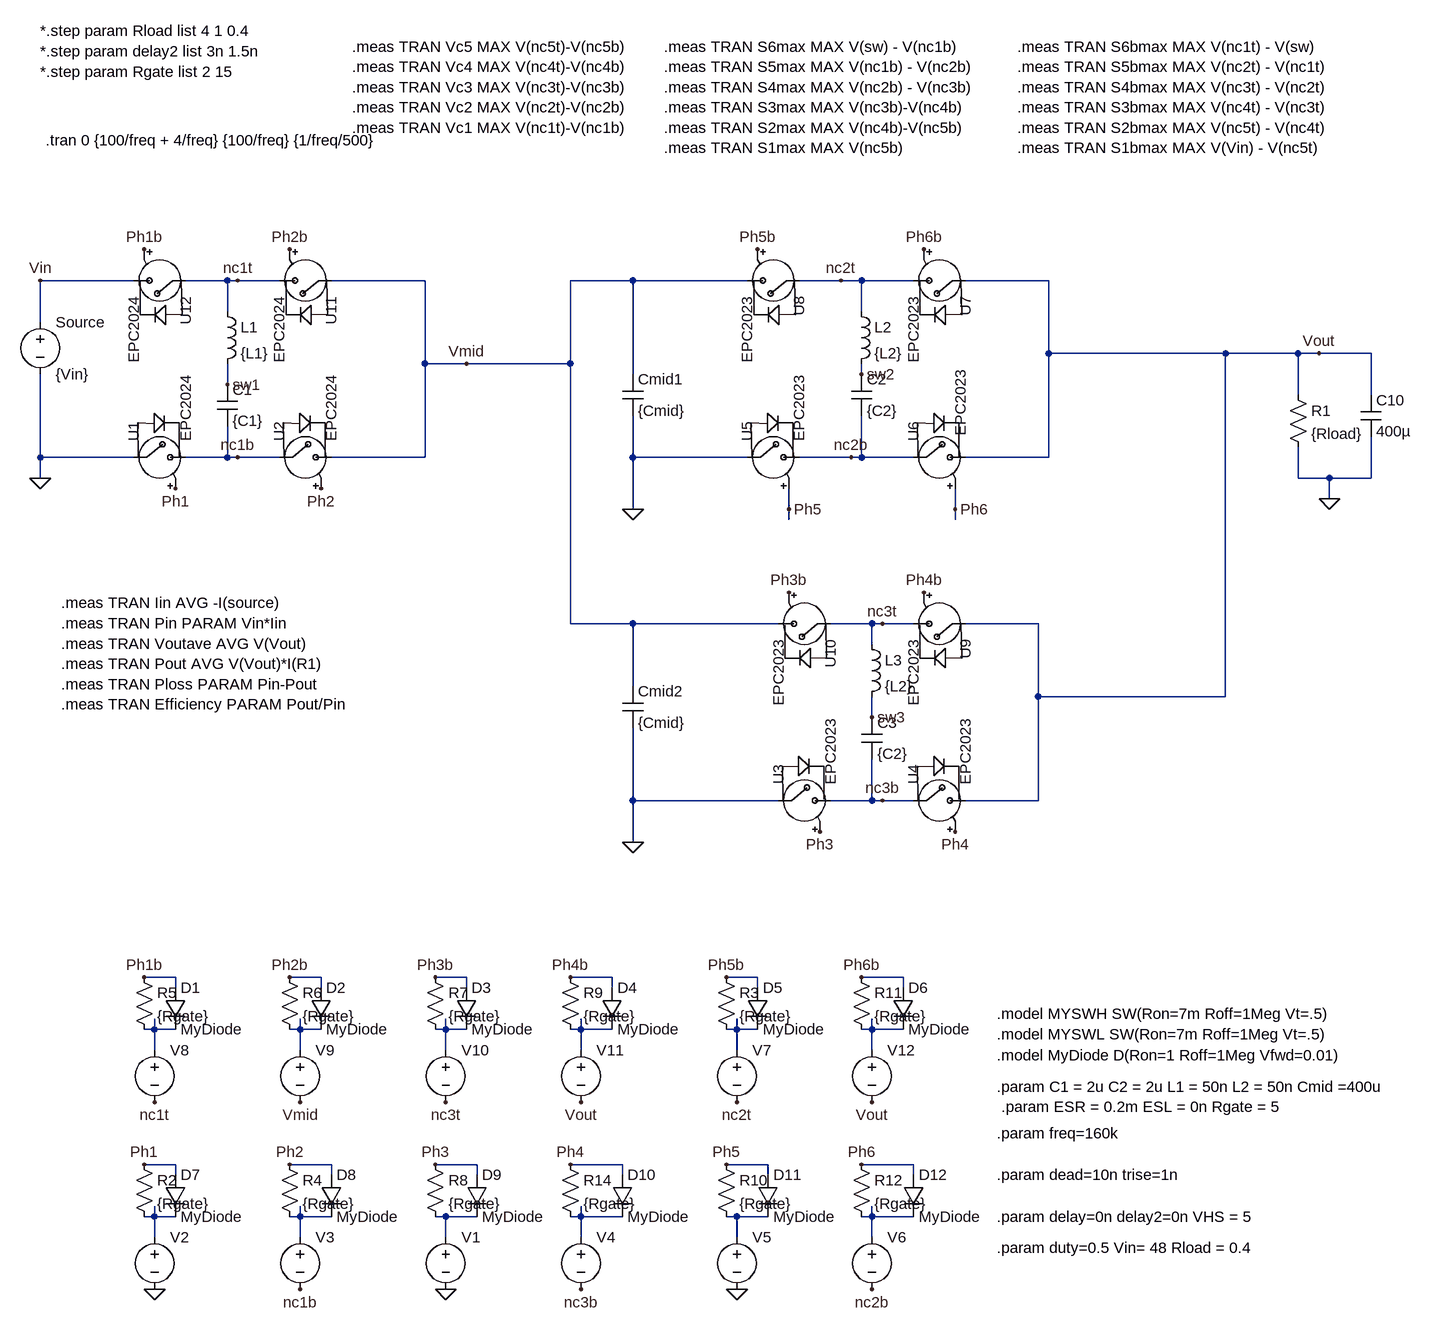
[diagram p0: schematic 3level_squared_EPC_distributed.asc]
3level_squared_EPC_distributed.asc, the LTspice schematic file:
Version 4
SHEET 1 1904 1740
WIRE -1152 80 -1296 80
WIRE -1008 80 -1072 80
WIRE -992 80 -1008 80
WIRE -928 80 -992 80
WIRE -704 80 -848 80
WIRE -384 80 -480 80
WIRE -208 80 -384 80
WIRE -64 80 -128 80
WIRE -32 80 -64 80
WIRE 48 80 -32 80
WIRE 256 80 128 80
WIRE -1008 128 -1008 80
WIRE -32 128 -32 80
WIRE -1296 144 -1296 80
WIRE 256 192 256 80
WIRE 528 192 256 192
WIRE 640 192 528 192
WIRE 672 192 640 192
WIRE 752 192 672 192
WIRE -704 208 -704 80
WIRE -640 208 -704 208
WIRE -480 208 -480 80
WIRE -480 208 -640 208
WIRE -384 224 -384 80
WIRE -32 224 -32 208
WIRE -1008 240 -1008 208
WIRE 640 256 640 192
WIRE 752 256 752 192
WIRE -1296 352 -1296 224
WIRE -1152 352 -1296 352
WIRE -1008 352 -1008 304
WIRE -1008 352 -1072 352
WIRE -992 352 -1008 352
WIRE -928 352 -992 352
WIRE -704 352 -704 208
WIRE -704 352 -848 352
WIRE -384 352 -384 288
WIRE -208 352 -384 352
WIRE -48 352 -128 352
WIRE -32 352 -32 288
WIRE -32 352 -48 352
WIRE 48 352 -32 352
WIRE 256 352 256 192
WIRE 256 352 128 352
WIRE -1296 384 -1296 352
WIRE 640 384 640 336
WIRE 688 384 640 384
WIRE 752 384 752 320
WIRE 752 384 688 384
WIRE 688 416 688 384
WIRE -384 432 -384 352
WIRE -144 432 -144 400
WIRE 112 432 112 400
WIRE -144 448 -144 432
WIRE 112 448 112 432
WIRE -480 608 -480 208
WIRE -384 608 -480 608
WIRE -160 608 -384 608
WIRE -16 608 -80 608
WIRE 0 608 -16 608
WIRE 48 608 0 608
WIRE 240 608 128 608
WIRE -16 640 -16 608
WIRE -384 704 -384 608
WIRE 240 720 240 608
WIRE 528 720 528 192
WIRE 528 720 240 720
WIRE -16 752 -16 720
WIRE -384 880 -384 768
WIRE -160 880 -384 880
WIRE -16 880 -16 816
WIRE -16 880 -80 880
WIRE 0 880 -16 880
WIRE 48 880 0 880
WIRE 240 880 240 720
WIRE 240 880 128 880
WIRE -384 944 -384 880
WIRE -1088 1152 -1136 1152
WIRE -864 1152 -912 1152
WIRE -640 1152 -688 1152
WIRE -416 1152 -480 1152
WIRE -192 1152 -240 1152
WIRE 32 1152 -32 1152
WIRE -1088 1168 -1088 1152
WIRE -864 1168 -864 1152
WIRE -640 1168 -640 1152
WIRE -416 1168 -416 1152
WIRE -192 1168 -192 1152
WIRE 32 1168 32 1152
WIRE -1120 1232 -1120 1216
WIRE -1120 1232 -1136 1232
WIRE -1088 1232 -1120 1232
WIRE -896 1232 -896 1216
WIRE -896 1232 -912 1232
WIRE -864 1232 -896 1232
WIRE -672 1232 -672 1216
WIRE -672 1232 -688 1232
WIRE -640 1232 -672 1232
WIRE -464 1232 -464 1216
WIRE -464 1232 -480 1232
WIRE -416 1232 -464 1232
WIRE -224 1232 -224 1216
WIRE -224 1232 -240 1232
WIRE -192 1232 -224 1232
WIRE -16 1232 -16 1216
WIRE -16 1232 -32 1232
WIRE 32 1232 -16 1232
WIRE -1120 1264 -1120 1232
WIRE -896 1264 -896 1232
WIRE -672 1264 -672 1232
WIRE -464 1264 -464 1232
WIRE -224 1264 -224 1232
WIRE -16 1264 -16 1232
WIRE -1088 1440 -1136 1440
WIRE -848 1440 -912 1440
WIRE -624 1440 -688 1440
WIRE -400 1440 -480 1440
WIRE -176 1440 -240 1440
WIRE 48 1440 -32 1440
WIRE -1088 1456 -1088 1440
WIRE -848 1456 -848 1440
WIRE -624 1456 -624 1440
WIRE -400 1456 -400 1440
WIRE -176 1456 -176 1440
WIRE 48 1456 48 1440
WIRE -1120 1520 -1120 1504
WIRE -1120 1520 -1136 1520
WIRE -1088 1520 -1120 1520
WIRE -896 1520 -896 1504
WIRE -896 1520 -912 1520
WIRE -848 1520 -896 1520
WIRE -672 1520 -688 1520
WIRE -624 1520 -672 1520
WIRE -464 1520 -464 1504
WIRE -464 1520 -480 1520
WIRE -400 1520 -464 1520
WIRE -224 1520 -240 1520
WIRE -176 1520 -224 1520
WIRE -16 1520 -16 1504
WIRE -16 1520 -32 1520
WIRE 48 1520 -16 1520
WIRE -1120 1552 -1120 1520
WIRE -896 1552 -896 1520
WIRE -672 1552 -672 1520
WIRE -464 1552 -464 1520
WIRE -224 1552 -224 1520
WIRE -16 1552 -16 1520
FLAG -1120 1632 0
FLAG -1136 1440 Ph1
FLAG -1296 80 Vin
FLAG 64 560 Ph4b
FLAG -144 560 Ph3b
FLAG -912 32 Ph2b
FLAG -1136 32 Ph1b
FLAG -912 1440 Ph2
FLAG 112 928 Ph4
FLAG -96 928 Ph3
FLAG -1088 400 Ph1
FLAG 688 416 0
FLAG -1296 384 0
FLAG -144 432 Ph5
FLAG 112 432 Ph6
FLAG -192 32 Ph5b
FLAG 64 32 Ph6b
FLAG -688 1440 Ph3
FLAG -480 1440 Ph4
FLAG -1136 1152 Ph1b
FLAG -912 1152 Ph2b
FLAG -688 1152 Ph3b
FLAG -480 1152 Ph4b
FLAG -992 80 nc1t
FLAG 0 608 nc3t
FLAG -16 752 sw3
FLAG -64 80 nc2t
FLAG -992 352 nc1b
FLAG 0 880 nc3b
FLAG -48 352 nc2b
FLAG -32 224 sw2
FLAG -864 400 Ph2
FLAG -896 1632 nc1b
FLAG -464 1632 nc3b
FLAG -464 1344 Vout
FLAG -672 1344 nc3t
FLAG -896 1344 Vmid
FLAG -1120 1344 nc1t
FLAG -384 432 0
FLAG -384 944 0
FLAG -672 1632 0
FLAG -1008 240 sw1
FLAG -240 1440 Ph5
FLAG -32 1440 Ph6
FLAG -240 1152 Ph5b
FLAG -32 1152 Ph6b
FLAG -16 1632 nc2b
FLAG -16 1344 Vout
FLAG -224 1344 nc2t
FLAG -224 1632 0
FLAG 672 192 Vout
FLAG -640 208 Vmid
SYMBOL voltage -1120 1536 R0
WINDOW 3 24 96 Invisible 2
SYMATTR Value PULSE(0 5 0 {trise} 1p {1/freq*(1-duty)} {1/freq})
SYMATTR InstName V2
SYMBOL voltage -1296 128 R0
WINDOW 123 0 0 Left 2
WINDOW 39 0 0 Left 2
SYMATTR InstName Source
SYMATTR Value {Vin}
SYMBOL voltage -896 1536 R0
WINDOW 3 24 96 Invisible 2
SYMATTR Value PULSE(0 {VHS} {1/freq/2+delay} {trise} 1p {1/freq*(1-duty)-delay+delay2} {1/freq})
SYMATTR InstName V3
SYMBOL cap -1024 240 R0
SYMATTR InstName C1
SYMATTR Value {C1}
SYMATTR SpiceLine Rser={ESR} Lser={ESL}
SYMATTR SpiceLine2 IC={Vin/2}
SYMBOL cap -32 752 R0
SYMATTR InstName C3
SYMATTR Value {C2}
SYMATTR SpiceLine Rser={ESR} Lser={ESL}
SYMATTR SpiceLine2 IC={Vin/4}
SYMBOL cap -48 224 R0
SYMATTR InstName C2
SYMATTR Value {C2}
SYMATTR SpiceLine Rser={ESR} Lser={ESL}
SYMATTR SpiceLine2 IC={Vin/4}
SYMBOL ind -48 112 R0
SYMATTR InstName L2
SYMATTR Value {L2}
SYMATTR SpiceLine Rser=0.1m
SYMBOL res 624 240 R0
SYMATTR InstName R1
SYMATTR Value {Rload}
SYMBOL cap 736 256 R0
SYMATTR InstName C10
SYMATTR Value 400µ
SYMATTR SpiceLine IC={Vin/4}
SYMATTR SpiceLine2 Rser=1m
SYMBOL voltage -672 1536 R0
WINDOW 3 24 96 Invisible 2
SYMATTR Value PULSE(0 5 0 {trise} 1p {1/freq*(1-duty)} {1/freq})
SYMATTR InstName V1
SYMBOL voltage -464 1536 R0
WINDOW 3 24 96 Invisible 2
SYMATTR Value PULSE(0 {VHS} {1/freq/2+delay} {trise} 1p {1/freq*(1-duty)-delay+delay2} {1/freq})
SYMATTR InstName V4
SYMBOL voltage -1120 1248 R0
WINDOW 3 24 96 Invisible 2
SYMATTR Value PULSE(0 {VHS} {1/freq*(1-duty)+dead+delay} {trise} 1p {1/freq*duty-dead*2-delay+delay2} {1/freq})
SYMATTR InstName V8
SYMBOL voltage -896 1248 R0
WINDOW 3 24 96 Invisible 2
SYMATTR Value PULSE(0 5 {1/freq/2+1/freq*(1-duty)+dead} {trise} 1p {1/freq*duty-dead*2} {1/freq})
SYMATTR InstName V9
SYMBOL voltage -672 1248 R0
WINDOW 3 24 44 Invisible 2
SYMATTR Value PULSE(0 {VHS} {1/freq*(1-duty)+dead+delay} {trise} 1p {1/freq*duty-dead*2-delay+delay2} {1/freq})
SYMATTR InstName V10
SYMBOL voltage -464 1248 R0
WINDOW 3 24 96 Invisible 2
SYMATTR Value PULSE(0 5 {1/freq/2+1/freq*(1-duty)+dead} {trise} 1p {1/freq*duty-dead*2} {1/freq})
SYMATTR InstName V11
SYMBOL EPCGaN_small -1168 352 R270
SYMATTR InstName U1
SYMATTR Value EPC2024
SYMBOL EPCGaN_small -944 352 R270
SYMATTR InstName U2
SYMATTR Value EPC2024
SYMBOL EPCGaN_small -176 880 R270
SYMATTR InstName U3
SYMATTR Value EPC2023
SYMBOL EPCGaN_small 32 880 R270
SYMATTR InstName U4
SYMATTR Value EPC2023
SYMBOL EPCGaN_small -224 352 R270
SYMATTR InstName U5
SYMATTR Value EPC2023
SYMBOL EPCGaN_small 32 352 R270
WINDOW 3 33 88 Left 2
SYMATTR Value EPC2023
SYMATTR InstName U6
SYMBOL EPCGaN_small 144 80 R90
SYMATTR InstName U7
SYMATTR Value EPC2023
SYMBOL EPCGaN_small -112 80 R90
SYMATTR InstName U8
SYMATTR Value EPC2023
SYMBOL EPCGaN_small 144 608 R90
SYMATTR InstName U9
SYMATTR Value EPC2023
SYMBOL EPCGaN_small -64 608 R90
SYMATTR InstName U10
SYMATTR Value EPC2023
SYMBOL EPCGaN_small -832 80 R90
SYMATTR InstName U11
SYMATTR Value EPC2024
SYMBOL EPCGaN_small -1056 80 R90
SYMATTR InstName U12
SYMATTR Value EPC2024
SYMBOL res -1152 1424 R0
SYMATTR InstName R2
SYMATTR Value {Rgate}
SYMBOL res -928 1424 R0
SYMATTR InstName R4
SYMATTR Value {Rgate}
SYMBOL res -1152 1136 R0
SYMATTR InstName R5
SYMATTR Value {Rgate}
SYMBOL res -928 1136 R0
SYMATTR InstName R6
SYMATTR Value {Rgate}
SYMBOL res -704 1136 R0
SYMATTR InstName R7
SYMATTR Value {Rgate}
SYMBOL res -704 1424 R0
SYMATTR InstName R8
SYMATTR Value {Rgate}
SYMBOL res -496 1136 R0
SYMATTR InstName R9
SYMATTR Value {Rgate}
SYMBOL res -496 1424 R0
SYMATTR InstName R14
SYMATTR Value {Rgate}
SYMBOL diode -1104 1168 R0
SYMATTR InstName D1
SYMATTR Value MyDiode
SYMBOL diode -880 1168 R0
SYMATTR InstName D2
SYMATTR Value MyDiode
SYMBOL diode -656 1168 R0
SYMATTR InstName D3
SYMATTR Value MyDiode
SYMBOL diode -432 1168 R0
SYMATTR InstName D4
SYMATTR Value MyDiode
SYMBOL diode -1104 1456 R0
SYMATTR InstName D7
SYMATTR Value MyDiode
SYMBOL diode -864 1456 R0
SYMATTR InstName D8
SYMATTR Value MyDiode
SYMBOL diode -640 1456 R0
SYMATTR InstName D9
SYMATTR Value MyDiode
SYMBOL diode -416 1456 R0
SYMATTR InstName D10
SYMATTR Value MyDiode
SYMBOL ind -1024 112 R0
SYMATTR InstName L1
SYMATTR Value {L1}
SYMATTR SpiceLine Rser=1m
SYMBOL cap -400 224 R0
SYMATTR InstName Cmid1
SYMATTR Value {Cmid}
SYMATTR SpiceLine IC={Vin/2}
SYMATTR SpiceLine2 Rser=0.2m
SYMBOL cap -400 704 R0
SYMATTR InstName Cmid2
SYMATTR Value {Cmid}
SYMATTR SpiceLine IC={Vin/2}
SYMATTR SpiceLine2 Rser=0.2m
SYMBOL ind -32 624 R0
SYMATTR InstName L3
SYMATTR Value {L2}
SYMATTR SpiceLine Rser=0.1m
SYMBOL voltage -224 1536 R0
WINDOW 3 24 96 Invisible 2
SYMATTR Value PULSE(0 {VHS} {1/freq/2+delay} {trise} 1p {1/freq*(1-duty)-delay+delay2} {1/freq})
SYMATTR InstName V5
SYMBOL voltage -16 1536 R0
WINDOW 3 24 96 Invisible 2
SYMATTR Value PULSE(0 5 0 {trise} 1p {1/freq*(1-duty)} {1/freq})
SYMATTR InstName V6
SYMBOL voltage -224 1248 R0
WINDOW 3 24 44 Invisible 2
SYMATTR Value PULSE(0 5 {1/freq/2+1/freq*(1-duty)+dead} {trise} 1p {1/freq*duty-dead*2} {1/freq})
SYMATTR InstName V7
SYMBOL voltage -16 1248 R0
WINDOW 3 24 96 Invisible 2
SYMATTR Value PULSE(0 {VHS} {1/freq*(1-duty)+dead+delay} {trise} 1p {1/freq*duty-dead*2-delay+delay2} {1/freq})
SYMATTR InstName V12
SYMBOL res -256 1136 R0
SYMATTR InstName R3
SYMATTR Value {Rgate}
SYMBOL res -256 1424 R0
SYMATTR InstName R10
SYMATTR Value {Rgate}
SYMBOL res -48 1136 R0
SYMATTR InstName R11
SYMATTR Value {Rgate}
SYMBOL res -48 1424 R0
SYMATTR InstName R12
SYMATTR Value {Rgate}
SYMBOL diode -208 1168 R0
SYMATTR InstName D5
SYMATTR Value MyDiode
SYMBOL diode 16 1168 R0
SYMATTR InstName D6
SYMATTR Value MyDiode
SYMBOL diode -192 1456 R0
SYMATTR InstName D11
SYMATTR Value MyDiode
SYMBOL diode 32 1456 R0
SYMATTR InstName D12
SYMATTR Value MyDiode
TEXT -1288 -136 Left 2 !.tran 0 {100/freq + 4/freq} {100/freq} {1/freq/500}
TEXT 176 1208 Left 2 !.model MYSWH SW(Ron=7m Roff=1Meg Vt=.5)\n.model MYSWL SW(Ron=7m Roff=1Meg Vt=.5)
TEXT 176 1272 Left 2 !.model MyDiode D(Ron=1 Roff=1Meg Vfwd=0.01)
TEXT 176 1520 Left 2 !.param delay=0n delay2=0n VHS = 5
TEXT 176 1392 Left 2 !.param freq=160k
TEXT 176 1568 Left 2 !.param duty=0.5 Vin= 48 Rload = 0.4
TEXT 176 1456 Left 2 !.param dead=10n trise=1n
TEXT 176 1320 Left 2 !.param C1 = 2u C2 = 2u L1 = 50n L2 = 50n Cmid =400u\n .param ESR = 0.2m ESL = 0n Rgate = 5
TEXT -336 -280 Left 2 !.meas TRAN S6max MAX V(sw) - V(nc1b)\n.meas TRAN S5max MAX V(nc1b) - V(nc2b)\n.meas TRAN S4max MAX V(nc2b) - V(nc3b)\n.meas TRAN S3max MAX V(nc3b)-V(nc4b)\n.meas TRAN S2max MAX V(nc4b)-V(nc5b)\n.meas TRAN S1max MAX V(nc5b)
TEXT -816 -280 Left 2 !.meas TRAN Vc5 MAX V(nc5t)-V(nc5b)\n.meas TRAN Vc4 MAX V(nc4t)-V(nc4b)\n.meas TRAN Vc3 MAX V(nc3t)-V(nc3b)\n.meas TRAN Vc2 MAX V(nc2t)-V(nc2b)\n.meas TRAN Vc1 MAX V(nc1t)-V(nc1b)
TEXT 208 -280 Left 2 !.meas TRAN S6bmax MAX V(nc1t) - V(sw) \n.meas TRAN S5bmax MAX V(nc2t) - V(nc1t) \n.meas TRAN S4bmax MAX V(nc3t) - V(nc2t) \n.meas TRAN S3bmax MAX V(nc4t) - V(nc3t)\n.meas TRAN S2bmax MAX V(nc5t) - V(nc4t)\n.meas TRAN S1bmax MAX V(Vin) - V(nc5t)
TEXT -1296 -304 Left 2 !*.step param Rload list 4 1 0.4\n*.step param delay2 list 3n 1.5n\n*.step param Rgate list 2 15
TEXT -1264 576 Left 2 !.meas TRAN Iin AVG -I(source)\n.meas TRAN Pin PARAM Vin*Iin\n.meas TRAN Voutave AVG V(Vout)\n.meas TRAN Pout AVG V(Vout)*I(R1)\n.meas TRAN Ploss PARAM Pin-Pout\n.meas TRAN Efficiency PARAM Pout/Pin

The netlist it stands for:
* 3level_squared_EPC_distributed.asc
V2 N007 0 PULSE(0 5 0 {trise} 1p {1/freq*(1-duty)} {1/freq})
V§Source Vin 0 {Vin}
V3 N008 nc1b PULSE(0 {VHS} {1/freq/2+delay} {trise} 1p {1/freq*(1-duty)-delay+delay2} {1/freq})
C1 sw1 nc1b {C1} Rser={ESR} Lser={ESL} IC={Vin/2}
C3 sw3 nc3b {C2} Rser={ESR} Lser={ESL} IC={Vin/4}
C2 sw2 nc2b {C2} Rser={ESR} Lser={ESL} IC={Vin/4}
L2 nc2t sw2 {L2} Rser=0.1m
R1 Vout 0 {Rload}
C10 Vout 0 400µ IC={Vin/4} Rser=1m
V1 N009 0 PULSE(0 5 0 {trise} 1p {1/freq*(1-duty)} {1/freq})
V4 N010 nc3b PULSE(0 {VHS} {1/freq/2+delay} {trise} 1p {1/freq*(1-duty)-delay+delay2} {1/freq})
V8 N001 nc1t PULSE(0 {VHS} {1/freq*(1-duty)+dead+delay} {trise} 1p {1/freq*duty-dead*2-delay+delay2} {1/freq})
V9 N002 Vmid PULSE(0 5 {1/freq/2+1/freq*(1-duty)+dead} {trise} 1p {1/freq*duty-dead*2} {1/freq})
V10 N003 nc3t PULSE(0 {VHS} {1/freq*(1-duty)+dead+delay} {trise} 1p {1/freq*duty-dead*2-delay+delay2} {1/freq})
V11 N004 Vout PULSE(0 5 {1/freq/2+1/freq*(1-duty)+dead} {trise} 1p {1/freq*duty-dead*2} {1/freq})
XU1 Ph1 nc1b 0 EPC2024  ; pins gatein drainin N_0
XU2 Ph2 Vmid nc1b EPC2024  ; pins gatein drainin N_0
XU3 Ph3 nc3b 0 EPC2023  ; pins gatein drainin N_0
XU4 Ph4 Vout nc3b EPC2023  ; pins gatein drainin N_0
XU5 Ph5 nc2b 0 EPC2023  ; pins gatein drainin N_0
XU6 Ph6 Vout nc2b EPC2023  ; pins gatein drainin N_0
XU7 Ph6b nc2t Vout EPC2023  ; pins gatein drainin N_0
XU8 Ph5b Vmid nc2t EPC2023  ; pins gatein drainin N_0
XU9 Ph4b nc3t Vout EPC2023  ; pins gatein drainin N_0
XU10 Ph3b Vmid nc3t EPC2023  ; pins gatein drainin N_0
XU11 Ph2b nc1t Vmid EPC2024  ; pins gatein drainin N_0
XU12 Ph1b Vin nc1t EPC2024  ; pins gatein drainin N_0
R2 Ph1 N007 {Rgate}
R4 Ph2 N008 {Rgate}
R5 Ph1b N001 {Rgate}
R6 Ph2b N002 {Rgate}
R7 Ph3b N003 {Rgate}
R8 Ph3 N009 {Rgate}
R9 Ph4b N004 {Rgate}
R14 Ph4 N010 {Rgate}
D1 Ph1b N001 MyDiode
D2 Ph2b N002 MyDiode
D3 Ph3b N003 MyDiode
D4 Ph4b N004 MyDiode
D7 Ph1 N007 MyDiode
D8 Ph2 N008 MyDiode
D9 Ph3 N009 MyDiode
D10 Ph4 N010 MyDiode
L1 nc1t sw1 {L1} Rser=1m
Cmid1 Vmid 0 {Cmid} IC={Vin/2} Rser=0.2m
Cmid2 Vmid 0 {Cmid} IC={Vin/2} Rser=0.2m
L3 nc3t sw3 {L2} Rser=0.1m
V5 N011 0 PULSE(0 {VHS} {1/freq/2+delay} {trise} 1p {1/freq*(1-duty)-delay+delay2} {1/freq})
V6 N012 nc2b PULSE(0 5 0 {trise} 1p {1/freq*(1-duty)} {1/freq})
V7 N005 nc2t PULSE(0 5 {1/freq/2+1/freq*(1-duty)+dead} {trise} 1p {1/freq*duty-dead*2} {1/freq})
V12 N006 Vout PULSE(0 {VHS} {1/freq*(1-duty)+dead+delay} {trise} 1p {1/freq*duty-dead*2-delay+delay2} {1/freq})
R3 Ph5b N005 {Rgate}
R10 Ph5 N011 {Rgate}
R11 Ph6b N006 {Rgate}
R12 Ph6 N012 {Rgate}
D5 Ph5b N005 MyDiode
D6 Ph6b N006 MyDiode
D11 Ph5 N011 MyDiode
D12 Ph6 N012 MyDiode
.model D D
.lib standard.dio
.tran 0 {100/freq + 4/freq} {100/freq} {1/freq/500}
.model MYSWH SW(Ron=7m Roff=1Meg Vt=.5)
.model MYSWL SW(Ron=7m Roff=1Meg Vt=.5)
.model MyDiode D(Ron=1 Roff=1Meg Vfwd=0.01)
.param delay=0n delay2=0n VHS = 5
.param freq=160k
.param duty=0.5 Vin= 48 Rload = 0.4
.param dead=10n trise=1n
.param C1 = 2u C2 = 2u L1 = 50n L2 = 50n Cmid =400u
 .param ESR = 0.2m ESL = 0n Rgate = 5
.meas TRAN S6max MAX V(sw) - V(nc1b)
.meas TRAN S5max MAX V(nc1b) - V(nc2b)
.meas TRAN S4max MAX V(nc2b) - V(nc3b)
.meas TRAN S3max MAX V(nc3b)-V(nc4b)
.meas TRAN S2max MAX V(nc4b)-V(nc5b)
.meas TRAN S1max MAX V(nc5b)
.meas TRAN Vc5 MAX V(nc5t)-V(nc5b)
.meas TRAN Vc4 MAX V(nc4t)-V(nc4b)
.meas TRAN Vc3 MAX V(nc3t)-V(nc3b)
.meas TRAN Vc2 MAX V(nc2t)-V(nc2b)
.meas TRAN Vc1 MAX V(nc1t)-V(nc1b)
.meas TRAN S6bmax MAX V(nc1t) - V(sw)
.meas TRAN S5bmax MAX V(nc2t) - V(nc1t)
.meas TRAN S4bmax MAX V(nc3t) - V(nc2t)
.meas TRAN S3bmax MAX V(nc4t) - V(nc3t)
.meas TRAN S2bmax MAX V(nc5t) - V(nc4t)
.meas TRAN S1bmax MAX V(Vin) - V(nc5t)
*.step param Rload list 4 1 0.4
*.step param delay2 list 3n 1.5n
*.step param Rgate list 2 15
.meas TRAN Iin AVG -I(source)
.meas TRAN Pin PARAM Vin*Iin
.meas TRAN Voutave AVG V(Vout)
.meas TRAN Pout AVG V(Vout)*I(R1)
.meas TRAN Ploss PARAM Pin-Pout
.meas TRAN Efficiency PARAM Pout/Pin
.lib EPCGanlibrary.lib
.backanno
.end